# Altium schematic sheet Handle.SchDoc
size A4
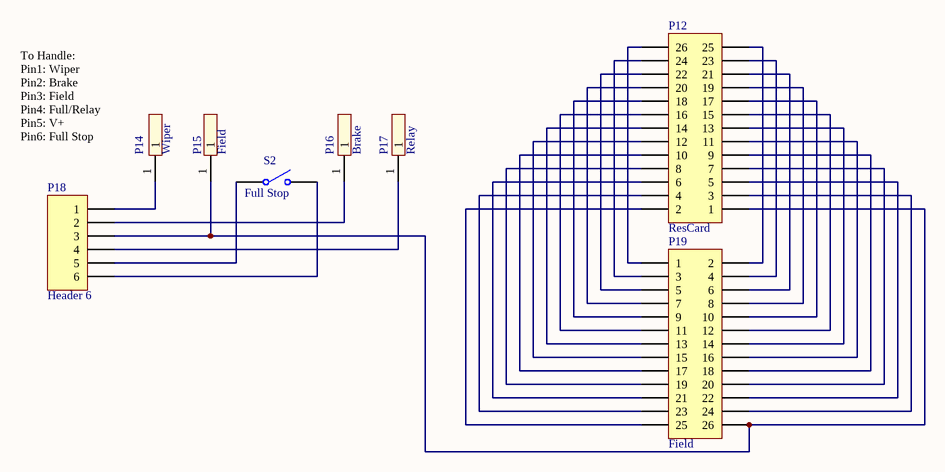
[diagram p0: Handle.SchDoc]

## Parts
P12  ResCard  [HDR2X13]
P14  Wiper  [1Pin]
P15  Field  [1Pin]
P16  Brake  [1Pin]
P17  Relay  [1Pin]
P18  Header 6  [Interconnect]
P19  Field  [Wiper Field]
S2  Full Stop  [HDR1X2]

## Nets
NetP12_1: P12.1 P15.1 P18.3 P19.26
NetP12_2: P12.2 P19.25
NetP12_3: P12.3 P19.24
NetP12_4: P12.4 P19.23
NetP12_5: P12.5 P19.22
NetP12_6: P12.6 P19.21
NetP12_7: P12.7 P19.20
NetP12_8: P12.8 P19.19
NetP12_9: P12.9 P19.18
NetP12_10: P12.10 P19.17
NetP12_11: P12.11 P19.16
NetP12_12: P12.12 P19.15
NetP12_13: P12.13 P19.14
NetP12_14: P12.14 P19.13
NetP12_15: P12.15 P19.12
NetP12_16: P12.16 P19.11
NetP12_17: P12.17 P19.10
NetP12_18: P12.18 P19.9
NetP12_19: P12.19 P19.8
NetP12_20: P12.20 P19.7
NetP12_21: P12.21 P19.6
NetP12_22: P12.22 P19.5
NetP12_23: P12.23 P19.4
NetP12_24: P12.24 P19.3
NetP12_25: P12.25 P19.2
NetP12_26: P12.26 P19.1
NetP14_1: P14.1 P18.1
NetP16_1: P16.1 P18.2
NetP17_1: P17.1 P18.4
NetP18_5: P18.5 S2.1(COMMON)
NetP18_6: P18.6 S2.2(NO)

## Notes on the sheet
- To Handle:
  Pin1: Wiper
  Pin2: Brake
  Pin3: Field
  Pin4: Full/Relay
  Pin5: V+
  Pin6: Full Stop

## Library data of the parts
P12 P19 = Header 13X2: Header, 13-Pin, Dual row; LatestRevisionDate: 17-Jul-2002; LatestRevisionNote: Re-released for DXP Platform.; Publisher: Altium Limited
P14 P16 P17 = Component_1
P15 = 1Pin
P18 = Header 6: Header, 6-Pin; LatestRevisionDate: 17-Jul-2002; LatestRevisionNote: Re-released for DXP Platform.; Publisher: Altium Limited
S2 = SW-SPST: Single-Pole, Single-Throw Switch; Published: 24-Mar-1999; LatestRevisionDate: 17-Jul-2002; LatestRevisionNote: Re-released for DXP Platform.; PackageReference: SPST-2; Publisher: Altium Limited; PackageDescription: Switch; 2 Leads